# EAGLE design driver_220v (EAGLE 7.5.0)
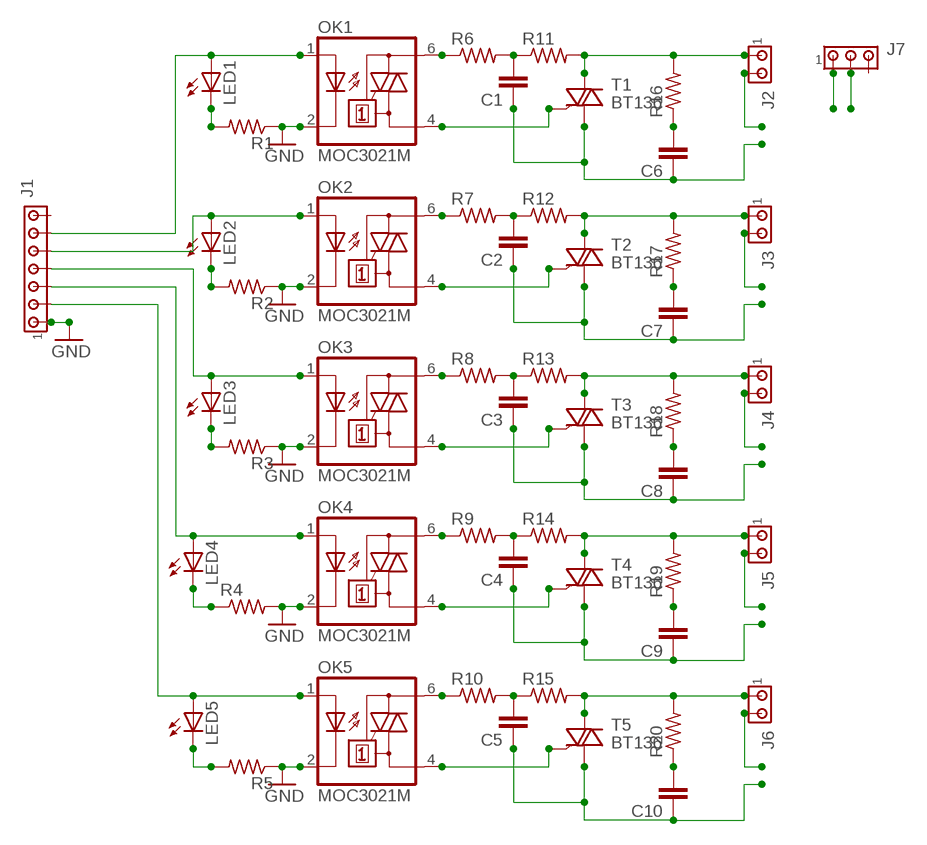
[diagram p0: schematic, sheet 1]

## Parts
C1  C2,5-3  [C2.5-3]
C2  C2,5-3  [C2.5-3]
C3  C2,5-3  [C2.5-3]
C4  C2,5-3  [C2.5-3]
C5  C2,5-3  [C2.5-3]
C6  C2,5-3  [C2.5-3]
C7  C2,5-3  [C2.5-3]
C8  C2,5-3  [C2.5-3]
C9  C2,5-3  [C2.5-3]
C10  C2,5-3  [C2.5-3]
J1  MTA07-100  [10X07MTA]
J2  MTA02-156  [1X2MTA]
J3  MTA02-156  [1X2MTA]
J4  MTA02-156  [1X2MTA]
J5  MTA02-156  [1X2MTA]
J6  MTA02-156  [1X2MTA]
J7  MTA03-156  [1X3MTA]
LED1  LED5MM  [LED5MM]
LED2  LED5MM  [LED5MM]
LED3  LED5MM  [LED5MM]
LED4  LED5MM  [LED5MM]
LED5  LED5MM  [LED5MM]
OK1  MOC3021M  [DIL06]
OK2  MOC3021M  [DIL06]
OK3  MOC3021M  [DIL06]
OK4  MOC3021M  [DIL06]
OK5  MOC3021M  [DIL06]
R1  R-US_R0603  [R0603]
R2  R-US_R0603  [R0603]
R3  R-US_R0603  [R0603]
R4  R-US_R0603  [R0603]
R5  R-US_R0603  [R0603]
R6  R-US_0207/10  [0207/10]
R7  R-US_0207/10  [0207/10]
R8  R-US_0207/10  [0207/10]
R9  R-US_0207/10  [0207/10]
R10  R-US_0207/10  [0207/10]
R11  R-US_0207/10  [0207/10]
R12  R-US_0207/10  [0207/10]
R13  R-US_0207/10  [0207/10]
R14  R-US_0207/10  [0207/10]
R15  R-US_0207/10  [0207/10]
R16  R-US_0207/10  [0207/10]
R17  R-US_0207/10  [0207/10]
R18  R-US_0207/10  [0207/10]
R19  R-US_0207/10  [0207/10]
R20  R-US_0207/10  [0207/10]
T1  BT136  [TO220AB]
T2  BT136  [TO220AB]
T3  BT136  [TO220AB]
T4  BT136  [TO220AB]
T5  BT136  [TO220AB]

## Nets
GND: J1.1 OK1.2(C) OK2.2(C) OK3.2(C) OK4.2(C) OK5.2(C) R1.1 R2.1 R3.1 R4.2 R5.1
LIVE: J2.2 J3.2 J4.2 J5.2 J6.2 J7.1
N$1: OK2.6(A2) R7.1
N$2: C2.2 R7.2 R12.1
N$3: J3.1 R12.2 R17.2 T2.2(A2)
N$4: OK2.4(A1) T2.3(G)
N$5: C7.2 R17.1
N$6: OK3.6(A2) R8.1
N$7: C3.2 R8.2 R13.1
N$8: J4.1 R13.2 R18.2 T3.2(A2)
N$9: OK3.4(A1) T3.3(G)
N$10: C8.2 R18.1
N$11: OK4.6(A2) R9.1
N$12: C4.2 R9.2 R14.1
N$13: J5.1 R14.2 R19.2 T4.2(A2)
N$14: OK4.4(A1) T4.3(G)
N$15: C9.2 R19.1
N$16: OK5.6(A2) R10.1
N$17: C5.2 R10.2 R15.1
N$18: J6.1 R15.2 R20.2 T5.2(A2)
N$19: OK5.4(A1) T5.3(G)
N$20: C10.2 R20.1
N$21: J1.6 LED1.A OK1.1(A)
N$22: J1.5 LED2.A OK2.1(A)
N$23: OK1.6(A2) R6.1
N$24: C1.2 R6.2 R11.1
N$25: J2.1 R11.2 R16.2 T1.2(A2)
N$26: OK1.4(A1) T1.3(G)
N$27: J1.4 LED3.A OK3.1(A)
N$28: C6.2 R16.1
N$29: J1.3 LED4.A OK4.1(A)
N$30: J1.2 LED5.A OK5.1(A)
N$31: LED5.K(C) R5.2
N$32: LED4.K(C) R4.1
N$33: LED3.K(C) R3.2
N$34: LED2.K(C) R2.2
N$35: LED1.K(C) R1.2
NEUTRAL: C1.1 C2.1 C3.1 C4.1 C5.1 C6.1 C7.1 C8.1 C9.1 C10.1 J7.2 T1.1(A1) T2.1(A1) T3.1(A1) T4.1(A1) T5.1(A1)
Unconnected: J1.7 J7.3

## Library data of the parts
C1-C10 = capacitor-wima:C: CAPACITOR naming: grid - package width
J1 = con-amp:MTA07-100: AMP connector
J2-J6 = con-amp:MTA02-156: AMP connector
J7 = con-amp:MTA03-156: AMP connector
LED1-LED5 = led:LED: LED OSRAM: - CHIPLED LG R971, LG N971, LY N971, LG Q971, LY Q971, LO R971, LY R971 LH N974, LH R974 LS Q976, LO Q976, LY Q976 LO Q996 - Hyper CHIPLED LW Q18S LB Q993, LB Q99A, LB R99A - SideLED LS A670, LO A670, LY A670, LG A670, LP A670 LB A673, LV A673, LT A673, LW A673 LH A674 LY A675 LS A676, LA A676, LO A676, LY A676, LW A676 LS A679, LY A679, LG A679 - Hyper Micro SIDELED® LS Y876, LA Y876, LO Y876, LY Y876 LT Y87S - SmartLED LW L88C, LW L88S LB L89C, LB L89S, LG L890 LS L89K, LO L89K, LY L89K LS L896, LA L896, LO L896, LY L896 - TOPLED LS T670, LO T670, LY T670, LG T670, LP T670 LSG T670, LSP T670, LSY T670, LOP T670, LYG T670 LG T671, LOG T671, LSG T671 LB T673, LV T673, LT T673, LW T673 LH T674 LS T676, LA T676, LO T676, LY T676, LB T676, LH T676, LSB T676, LW T676 LB T67C, LV T67C, LT T67C, LS T67K, LO T67K, LY T67K, LW E67C LS E67B, LA E67B, LO E67B, LY E67B, LB E67C, LV E67C, LT E67C LW T67C LS T679, LY T679, LG T679 LS T770, LO T770, LY T770, LG T770, LP T770 LB T773, LV T773, LT T773, LW T773 LH T774 LS E675, LA E675, LY E675, LS T675 LS T776, LA T776, LO T776, LY T776, LB T776 LHGB T686 LT T68C, LB T68C - Hyper Mini TOPLED® LB M676 - Mini TOPLED Santana® LG M470 LS M47K, LO M47K, LY M47K Source: http://www.osram.convergy.de LUXEON: - LUMILED® LXK2-PW12-R00, LXK2-PW12-S00, LXK2-PW14-U00, LXK2-PW14-V00 LXK2-PM12-R00, LXK2-PM12-S00, LXK2-PM14-U00 LXK2-PE12-Q00, LXK2-PE12-R00, LXK2-PE12-S00, LXK2-PE14-T00, LXK2-PE14-U00 LXK2-PB12-K00, LXK2-PB12-L00, LXK2-PB12-M00, LXK2-PB14-N00, LXK2-PB14-P00, LXK2-PB14-Q00 LXK2-PR12-L00, LXK2-PR12-M00, LXK2-PR14-Q00, LXK2-PR14-R00 LXK2-PD12-Q00, LXK2-PD12-R00, LXK2-PD12-S00 LXK2-PH12-R00, LXK2-PH12-S00 LXK2-PL12-P00, LXK2-PL12-Q00, LXK2-PL12-R00 Source: www.luxeon.com KINGBRIGHT: KA-3528ASYC Source: www.kingbright.com
OK1-OK5 = optocoupler:MOC30*M: RANDOM-PHASE OPTOISOLATORS TRIAC DRIVER OUTPUT Source: http://www.fairchildsemi.com MOC3020-M.pdf; MF: FAIRCHILD SEMICONDUCTOR; MPN: MOC3021-M; OC_FARNELL: 1021365; OC_NEWARK: 95B7895
R1-R5 = resistor:R-US_: RESISTOR, American symbol
R6-R20 = rcl:R-US_: RESISTOR, American symbol
T1-T5 = triac:BT136: Triac BT136 series E sensitive gate Source: http://www.nxp.com/acrobat_download/datasheets/BT136_SERIES_E_2.pdf

## Board
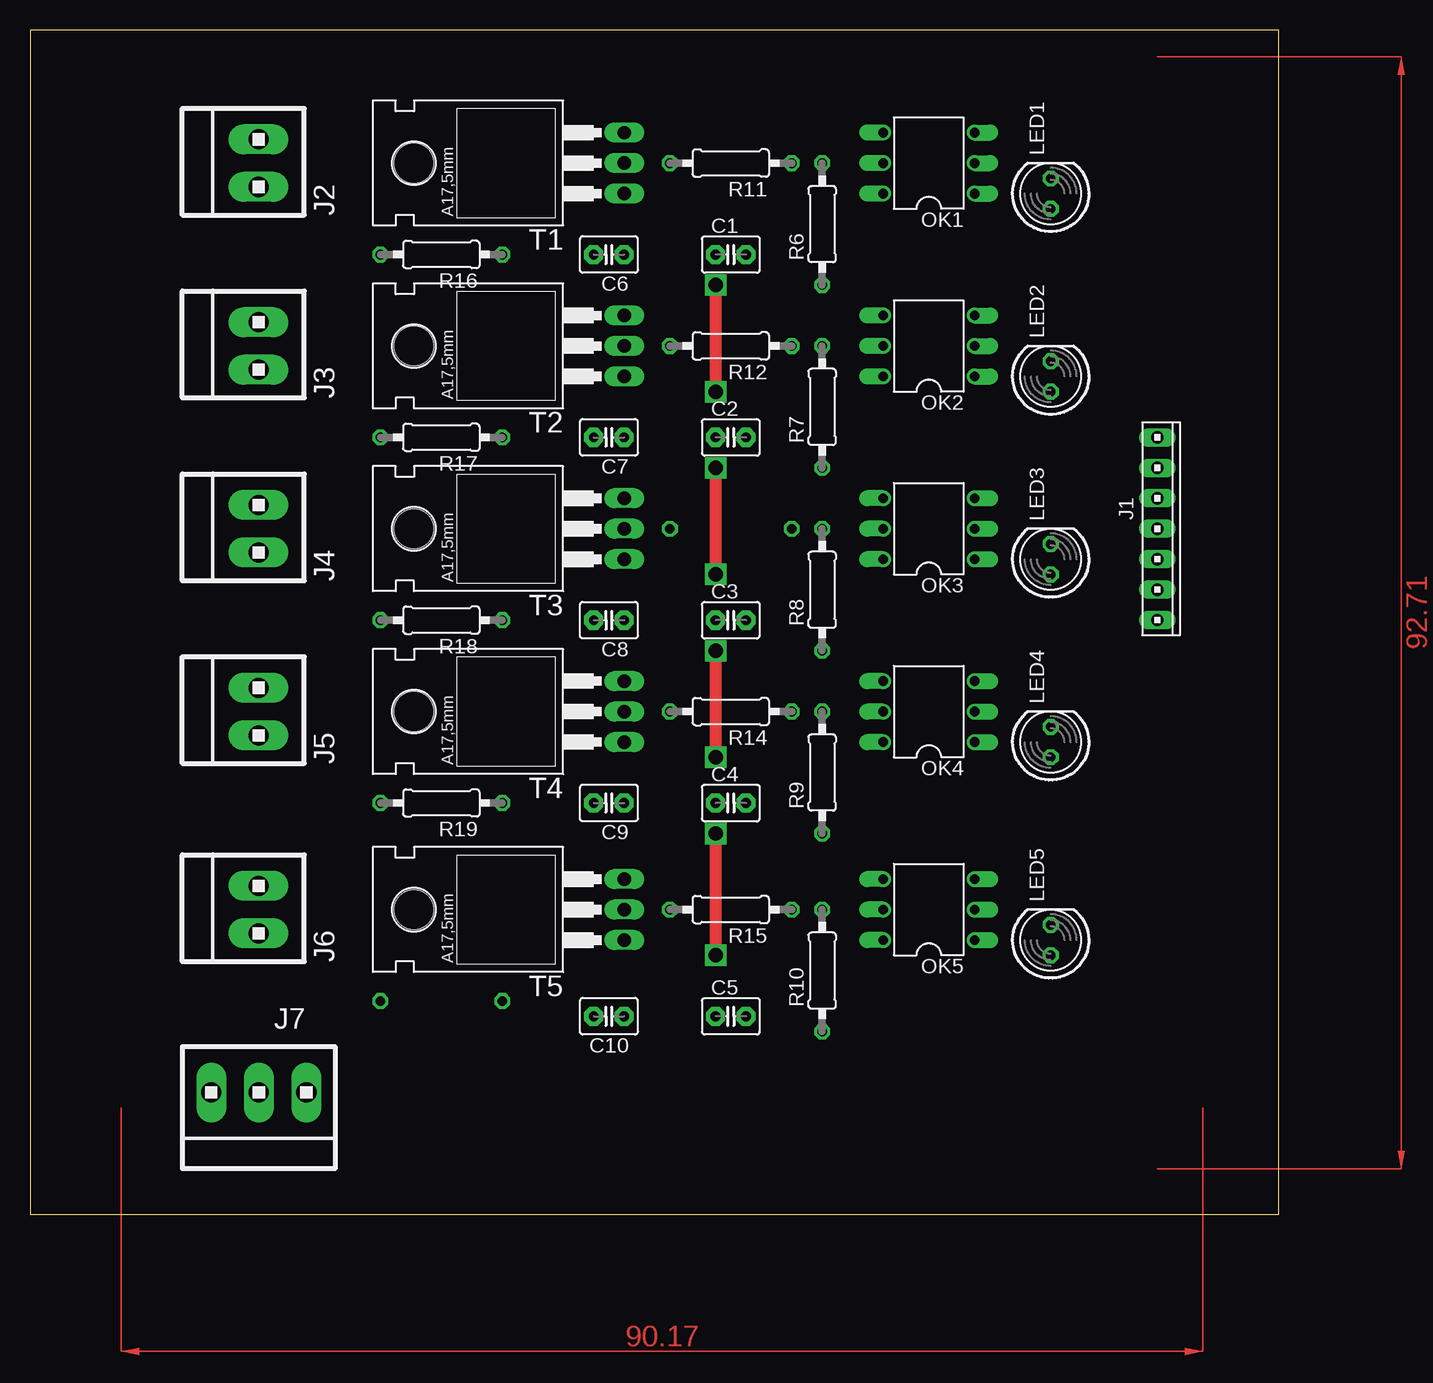
[diagram p1: board, top side]
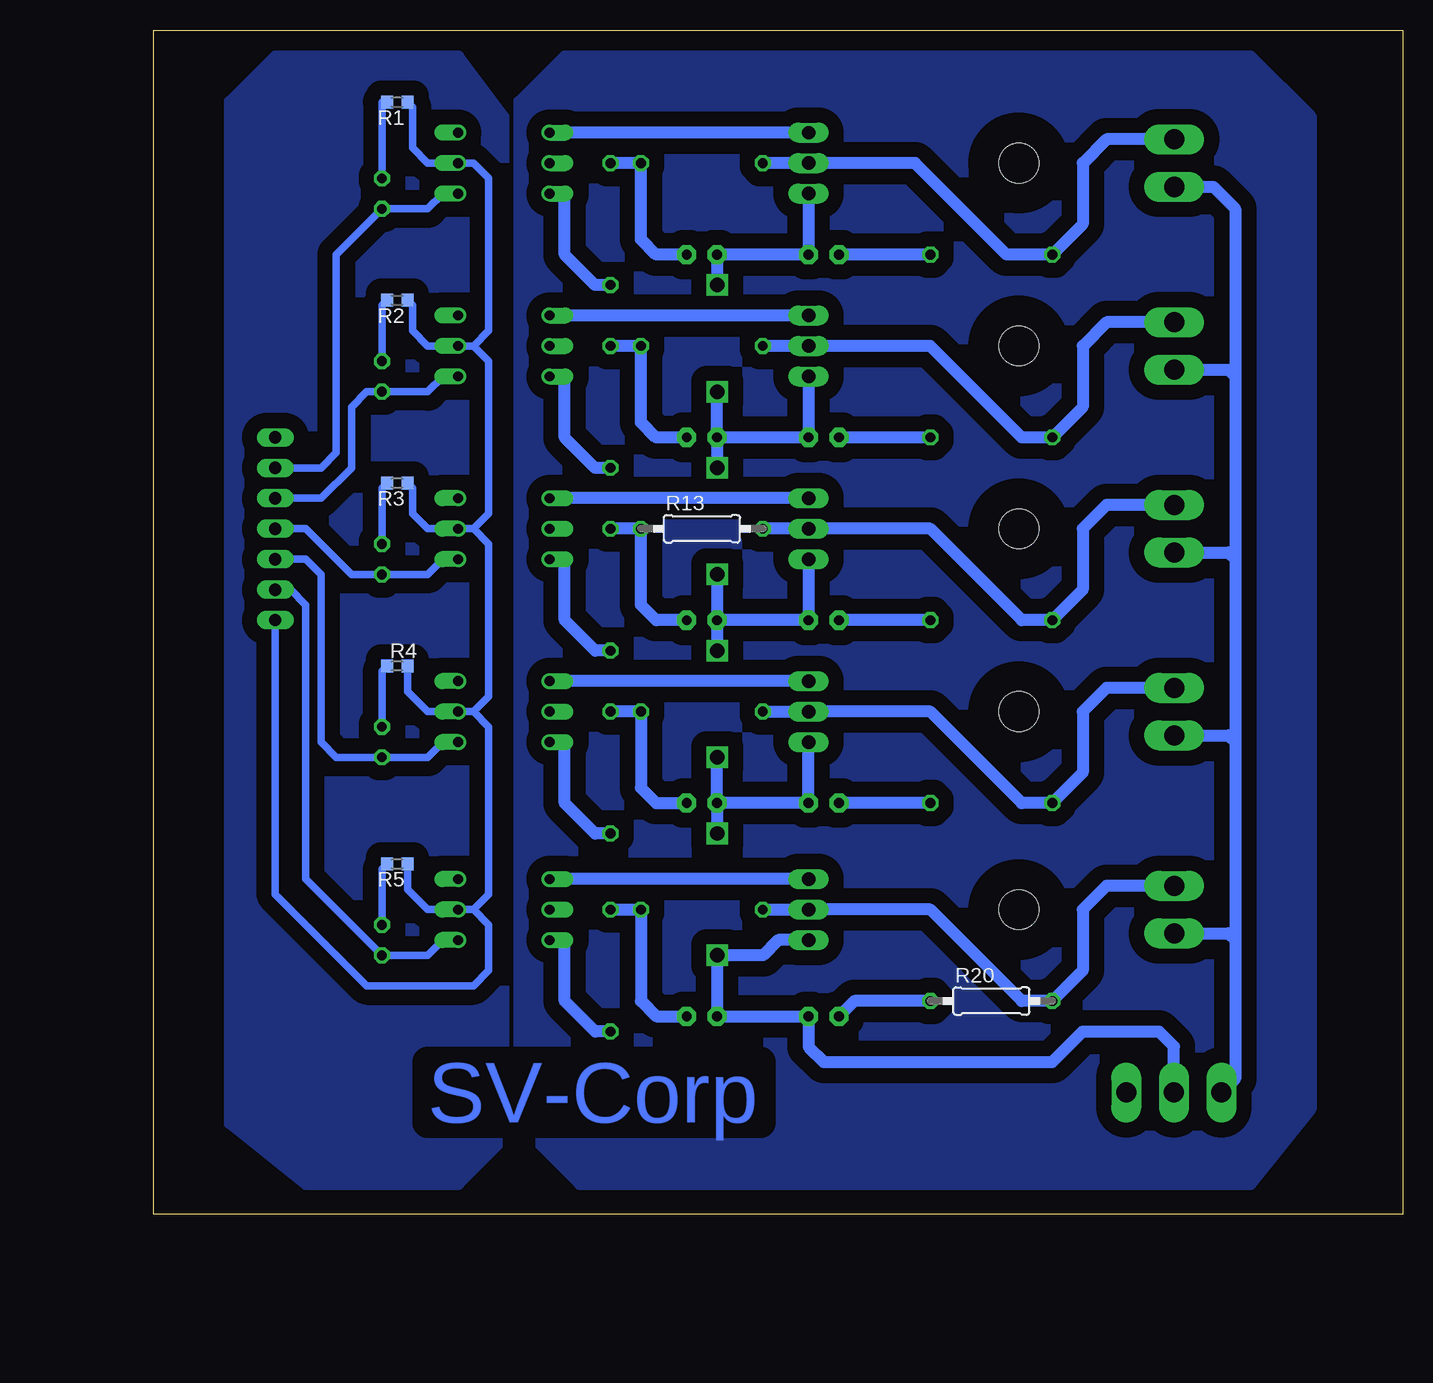
[diagram p2: board, bottom side, seen from below]

Size 104.12 x 98.73 mm. Coordinates in mm from the lower left corner, seen from the top.
Outline: 0,0 104.12,0 104.12,98.73 0,98.73 0,0
Copper layers (1*16): Top 0.035mm / dielectric 1.5mm / Bottom 0.035mm
Design rules "default": minimum track width 10mil, minimum drill 24mil, track to track 8mil, track to pad 8mil, pad to pad 8mil, via to via 8mil, smd to smd 8mil, copper to edge 40mil, drill to drill 8mil, minimum pad ring 10mil, minimum via ring 8mil, stop-mask expansion 4mil, vias tented up to drill 0mil, thermal gap 10mil

### Footprints (pad centres in the part's own frame; a part is rotated, then mirrored left to right if it is on the bottom)
C2.5-3 = drill 0.813 pad 1.6 octagon: 1 -1.27,0; 2 1.27,0
10X07MTA = drill 1.016 long: 1 7.62,0; 2 5.08,0; 3 2.54,0; 4 0,0; 5 -2.54,0; 6 -5.08,0; 7 -7.62,0
1X2MTA = drill 1.676 long: 1 1.981,0; 2 -1.981,0
1X3MTA = drill 1.676 long: 1 3.937,0; 2 -0.025,0; 3 -3.988,0
LED5MM = drill 0.813 octagon: A -1.27,0; K 1.27,0
DIL06 = drill 0.813 offset: 1 -2.54,-3.81; 2 0,-3.81; 3 2.54,-3.81; 4 2.54,3.81; 5 0,3.81; 6 -2.54,3.81
R0603 = smd 1 x 1.1: 1 -0.85,0; 2 0.85,0
0207/10 = drill 0.813 octagon: 1 -5.08,0; 2 5.08,0
TO220AB = drill 1.118 long: 1 -2.54,-6.35; 2 0,-6.35; 3 2.54,-6.35 | hole 3.302: 0,11.176

### Placement (x,y rotation side)
C1  58.42,80.01 0 top
C2  58.42,64.77 0 top
C3  58.42,49.53 0 top
C4  58.42,34.29 0 top
C5  58.42,16.51 0 top
C6  48.26,80.01 180 top
C7  48.26,64.77 180 top
C8  48.26,49.53 180 top
C9  48.26,34.29 180 top
C10  48.26,16.51 180 top
J1  93.98,57.15 270 top
J2  19.05,87.63 90 top
J3  19.05,72.39 90 top
J4  19.05,57.15 90 top
J5  19.05,41.91 90 top
J6  19.05,25.4 90 top
J7  19.05,10.16 180 top
LED1  85.09,85.09 90 top
LED2  85.09,69.85 90 top
LED3  85.09,54.61 90 top
LED4  85.09,39.37 90 top
LED5  85.09,22.86 90 top
OK1  74.93,87.63 90 top
OK2  74.93,72.39 90 top
OK3  74.93,57.15 90 top
OK4  74.93,41.91 90 top
OK5  74.93,25.4 90 top
R1  83.82,92.71 180 bottom
R2  83.82,76.2 180 bottom
R3  83.82,60.96 180 bottom
R4  83.82,45.72 0 bottom
R5  83.82,29.21 180 bottom
R6  66.04,82.55 90 top
R7  66.04,67.31 90 top
R8  66.04,52.07 90 top
R9  66.04,36.83 90 top
R10  66.04,20.32 90 top
R11  58.42,87.63 180 top
R12  58.42,72.39 180 top
R13  58.42,57.15 0 bottom
R14  58.42,41.91 180 top
R15  58.42,25.4 180 top
R16  34.29,80.01 180 top
R17  34.29,64.77 180 top
R18  34.29,49.53 180 top
R19  34.29,34.29 180 top
R20  34.29,17.78 0 bottom
T1  43.18,87.63 90 top
T2  43.18,72.39 90 top
T3  43.18,57.15 90 top
T4  43.18,41.91 90 top
T5  43.18,25.4 90 top

### Tracks (layer width: path | path; a pad name or v marks a point on that pad's centre or on a via)
GND
  Bottom 0.61: 77.47,72.39 76.2,73.66 76.2,86.36 77.47,87.63 OK1.2 81.28,87.63 82.55,88.9 82.55,92.29 R1.1 | 77.47,72.39 OK2.2 81.28,72.39 82.55,73.66 82.55,75.78 R2.1 | 77.47,57.15 OK3.2 81.28,57.15 82.55,58.42 82.55,60.54 R3.1 | 77.47,57.15 76.2,58.42 76.2,71.12 77.47,72.39 | 77.47,41.91 OK4.2 81.28,41.91 82.97,43.6 R4.2 | 77.47,41.91 76.2,43.18 76.2,55.88 77.47,57.15 | 77.47,25.4 OK5.2 81.28,25.4 82.97,27.09 R5.1 | 77.47,25.4 76.2,26.67 76.2,40.64 77.47,41.91 | J1.1 93.98,26.67 86.36,19.05 77.47,19.05 76.2,20.32 76.2,24.13 77.47,25.4
LIVE
  Bottom 1.016: J2.2 15.8,85.65 13.97,83.82 13.97,69.85 | 13.97,69.85 13.97,54.61 | 13.97,54.61 13.97,39.37 | 13.97,39.37 13.97,22.86 | 13.97,22.86 13.97,11.3 J7.1 | J6.2 14.53,23.42 13.97,22.86 | J5.2 14.53,39.93 13.97,39.37 | J4.2 14.53,55.17 13.97,54.61 | J3.2 14.53,70.41 13.97,69.85
N$1
  Bottom 1.016: R7.1 67.31,62.23 69.85,64.77 69.85,69.85 OK2.6
N$2
  Bottom 1.016: R7.2 R12.1 63.5,66.04 62.23,64.77 C2.2
N$3
  Bottom 1.016: J3.1 24.69,74.37 26.67,72.39 26.67,67.31 R17.2 31.75,64.77 39.37,72.39 T2.2 R12.2
N$4
  Bottom 1.016: T2.3 OK2.4
N$5
  Bottom 1.016: R17.1 C7.2
N$6
  Bottom 1.016: R8.1 67.31,46.99 69.85,49.53 69.85,54.61 OK3.6
N$7
  Bottom 1.016: R8.2 R13.1 63.5,50.8 62.23,49.53 C3.2
N$8
  Bottom 1.016: J4.1 24.69,59.13 26.67,57.15 26.67,52.07 R18.2 31.75,49.53 39.37,57.15 T3.2 R13.2
N$9
  Bottom 1.016: T3.3 OK3.4
N$10
  Bottom 1.016: R18.1 C8.2
N$11
  Bottom 1.016: R9.1 67.31,31.75 69.85,34.29 69.85,39.37 OK4.6
N$12
  Bottom 1.016: R9.2 R14.1 63.5,35.56 62.23,34.29 C4.2
N$13
  Bottom 1.016: J5.1 24.69,43.89 26.67,41.91 26.67,36.83 R19.2 31.75,34.29 39.37,41.91 T4.2 R14.2
N$14
  Bottom 1.016: T4.3 OK4.4
N$15
  Bottom 1.016: R19.1 C9.2
N$16
  Bottom 1.016: R10.1 67.31,15.24 69.85,17.78 69.85,22.86 OK5.6
N$17
  Bottom 1.016: R10.2 R15.1 63.5,17.78 62.23,16.51 C5.2
N$18
  Bottom 1.016: J6.1 24.69,27.38 26.67,25.4 26.67,20.32 R20.2 31.75,17.78 39.37,25.4 T5.2 R15.2
N$19
  Bottom 1.016: T5.3 OK5.4
N$20
  Bottom 1.016: R20.1 45.72,17.78 C10.2
N$21
  Bottom 0.61: OK1.1 80.01,85.09 81.28,83.82 LED1.A 88.9,80.01 88.9,63.5 90.17,62.23 J1.6
N$22
  Bottom 0.61: OK2.1 80.01,69.85 81.28,68.58 LED2.A 86.36,68.58 87.63,67.31 87.63,62.23 90.17,59.69 J1.5
N$23
  Bottom 1.016: R6.1 67.31,77.47 69.85,80.01 69.85,85.09 OK1.6
N$24
  Bottom 1.016: R6.2 R11.1 63.5,81.28 62.23,80.01 C1.2
N$25
  Bottom 1.016: J2.1 24.69,89.61 26.67,87.63 26.67,82.55 R16.2 33.02,80.01 40.64,87.63 T1.2 R11.2
N$26
  Bottom 1.016: T1.3 OK1.4
N$27
  Bottom 0.61: OK3.1 80.01,54.61 81.28,53.34 LED3.A 87.63,53.34 91.44,57.15 J1.4
N$28
  Bottom 1.016: R16.1 C6.2
N$29
  Bottom 0.61: OK4.1 80.01,39.37 81.28,38.1 LED4.A 88.9,38.1 90.17,39.37 90.17,53.34 91.44,54.61 J1.3
N$30
  Bottom 0.61: OK5.1 80.01,22.86 81.28,21.59 LED5.A 91.44,27.94 91.44,50.8 92.71,52.07 J1.2
N$31
  Bottom 0.61: LED5.K 85.09,28.79 R5.2
N$32
  Bottom 0.61: LED4.K 85.09,45.3 R4.1
N$33
  Bottom 0.61: LED3.K 85.09,60.54 R3.2
N$34
  Bottom 0.61: LED2.K 85.09,75.78 R2.2
N$35
  Bottom 0.61: R1.2 85.09,92.71 LED1.K
N$36
  pour Bottom (isolate 1.27): 12.7,96.52 69.85,96.52 73.66,92.71 73.66,7.62 68.58,2.54 12.7,2.54 7.62,8.89 7.62,91.44
N$37
  pour Bottom (isolate 1.27): 78.74,96.52 93.98,96.52 97.79,92.71 97.79,7.62 91.44,2.54 78.74,2.54 74.93,6.35 74.93,91.44
NEUTRAL  (via drill 1.2)
  Top 1.016: v57.15,77.47 v57.15,68.58 | v57.15,62.23 v57.15,53.34 | v57.15,46.99 v57.15,38.1 | v57.15,31.75 v57.15,21.59
  Bottom 1.016: J7.2 19.07,13.99 20.32,15.24 26.67,15.24 29.21,12.7 48.26,12.7 49.53,13.97 C10.1 C5.1 v57.15,21.59 53.34,21.59 52.07,22.86 T5.1 | T1.1 C6.1 C1.1 v57.15,77.47 | T2.1 C7.1 C2.1 | T3.1 C8.1 C3.1 | T4.1 C9.1 C4.1 | C4.1 v57.15,31.75 | C4.1 v57.15,38.1 | C3.1 v57.15,46.99 | v57.15,53.34 C3.1 | C2.1 v57.15,62.23 | C2.1 v57.15,68.58
(copper drawn outside any net)
  shapes: Top area x2

### Text on the board
Bottom: SV-Corp